# EAGLE schematic pm2018 (EAGLE 9.0.0)
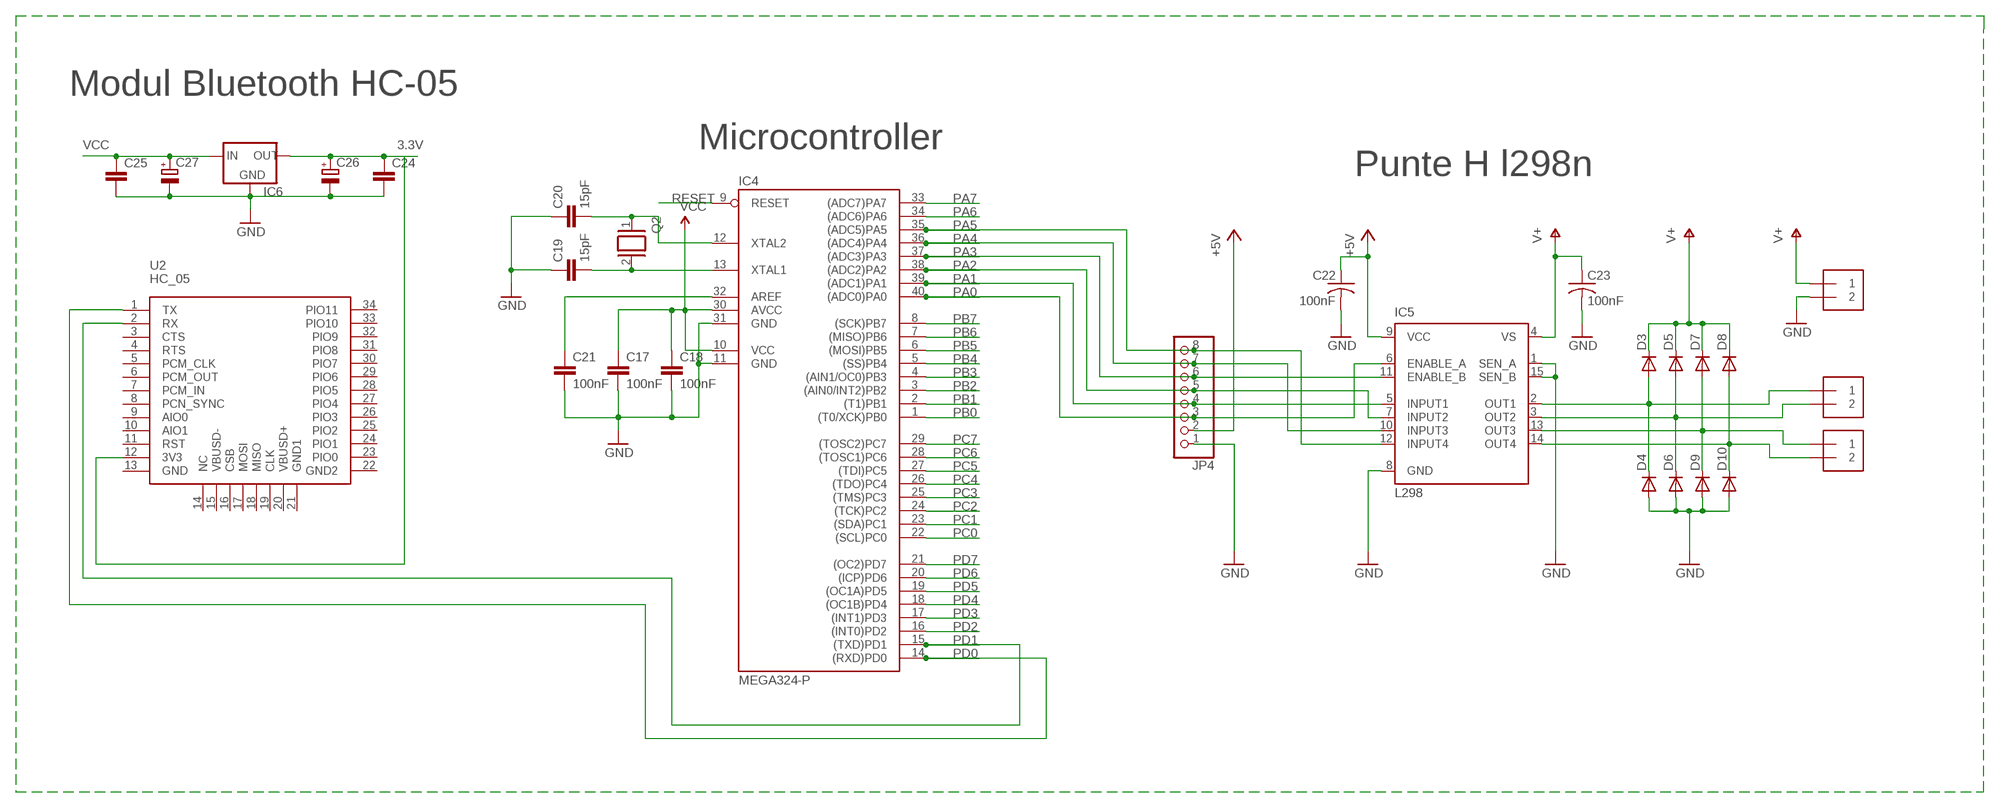
[diagram p0: schematic, sheet 1]

## Parts
C17  100nF  C-EUC_PM  [C025-025X050]
C18  100nF  C-EUC_PM  [C025-025X050]
C19  15pF  C-EUC_PM  [C025-025X050]
C20  15pF  C-EUC_PM  [C025-025X050]
C21  100nF  C-EUC_PM  [C025-025X050]
C22  100nF  C-US050-024X044  [C050-024X044]
C23  100nF  C-US050-024X044  [C050-024X044]
C24  C2,5-3  [C2.5-3]
C25  C2,5-3  [C2.5-3]
C26  CPOL-EUE5-5  [E5-5]
C27  CPOL-EUE5-5  [E5-5]
D3  DIODE-D-5  [D-5]
D4  DIODE-D-5  [D-5]
D5  DIODE-D-5  [D-5]
D6  DIODE-D-5  [D-5]
D7  DIODE-D-5  [D-5]
D8  DIODE-D-5  [D-5]
D9  DIODE-D-5  [D-5]
D10  DIODE-D-5  [D-5]
IC4  MEGA324-P  MEGA16-P  [DIL40]
IC5  L298  [MULTIWATT-15]
IC6  MCP1700INLINE  [TO92-INLINE]
J4  1X2-3.5MM  [1X2-3.5MM]
J5  1X2-3.5MM  [1X2-3.5MM]
J6  1X2-3.5MM  [1X2-3.5MM]
JP4  PINHD-1X8  [1X08]
Q2  XTAL/S  [QS]
U2  HC_05  [BLUETOOTH_SMD]

## Nets
3.3V: C24.1 C26.+ IC6.3(OUT) U2.12(3V3)
+5V: C22.1 IC5.9(VCC) JP4.2
GND: C17.2 C18.2 C19.1 C20.1 C21.2 C22.2 C23.2 C24.2 C25.2 C26.- C27.- D4.A D6.A D9.A D10.A IC4.11(GND) IC4.31(GND) IC5.1(SEN_A) IC5.8(GND) IC5.15(SEN_B) IC6.1(GND) J4.2 JP4.1
N$11: D3.A D4.C IC5.2(OUT1) J5.1
N$12: D5.A D6.C IC5.3(OUT2) J5.2
N$13: C21.1 IC4.32(AREF)
N$19: C19.2 IC4.13(XTAL1) Q2.2
N$23: C20.2 IC4.12(XTAL2) Q2.1
N$24: D8.A D10.C IC5.14(OUT4) J6.2
N$25: D7.A D9.C IC5.13(OUT3) J6.1
PA0: IC4.40((ADC0)PA0) IC5.6(ENABLE_A) JP4.3
PA1: IC4.39((ADC1)PA1) IC5.5(INPUT1) JP4.4
PA2: IC4.38((ADC2)PA2) IC5.7(INPUT2) JP4.5
PA3: IC4.37((ADC3)PA3) IC5.11(ENABLE_B) JP4.6
PA4: IC4.36((ADC4)PA4) IC5.10(INPUT3) JP4.7
PA5: IC4.35((ADC5)PA5) IC5.12(INPUT4) JP4.8
PA6: IC4.34((ADC6)PA6)
PA7: IC4.33((ADC7)PA7)
PB0: IC4.1((T0/XCK)PB0)
PB1: IC4.2((T1)PB1)
PB2: IC4.3((AIN0/INT2)PB2)
PB3: IC4.4((AIN1/OC0)PB3)
PB4: IC4.5((SS)PB4)
PB5: IC4.6((MOSI)PB5)
PB6: IC4.7((MISO)PB6)
PB7: IC4.8((SCK)PB7)
PC0: IC4.22((SCL)PC0)
PC1: IC4.23((SDA)PC1)
PC2: IC4.24((TCK)PC2)
PC3: IC4.25((TMS)PC3)
PC4: IC4.26((TDO)PC4)
PC5: IC4.27((TDI)PC5)
PC6: IC4.28((TOSC1)PC6)
PC7: IC4.29((TOSC2)PC7)
PD0: IC4.14((RXD)PD0) U2.1(TX)
PD1: IC4.15((TXD)PD1) U2.2(RX)
PD2: IC4.16((INT0)PD2)
PD3: IC4.17((INT1)PD3)
PD4: IC4.18((OC1B)PD4)
PD5: IC4.19((OC1A)PD5)
PD6: IC4.20((ICP)PD6)
PD7: IC4.21((OC2)PD7)
RESET: IC4.9(RESET)
V+: C23.1 D3.C D5.C D7.C D8.C IC5.4(VS) J4.1
VCC: C17.1 C18.1 C25.1 C27.+ IC4.10(VCC) IC4.30(AVCC) IC6.2(IN)
Unconnected: U2.3(CTS) U2.4(RTS) U2.5(PCM_CLK) U2.6(PCM_OUT) U2.7(PCM_IN) U2.8(PCN_SYNC) U2.9(AIO0) U2.10(AIO1) U2.11(RST) U2.13(GND) U2.14(NC) U2.15(VBUSD-) U2.16(CSB) U2.17(MOSI) U2.18(MISO) U2.19(CLK) U2.20(VBUSD+) U2.21(GND1) U2.22(GND2) U2.23(PIO0) U2.24(PIO1) U2.25(PIO2) U2.26(PIO3) U2.27(PIO4) U2.28(PIO5) U2.29(PIO6) U2.30(PIO7) U2.31(PIO8) U2.32(PIO9) U2.33(PIO10) U2.34(PIO11)

## Notes on the sheet
- Modul Bluetooth HC-05
- Microcontroller
- Punte H l298n

## Library data of the parts
C17-C21 = 0andrei_custom:C-EU: CAPACITOR, European symbol
C22 C23 = rcl:C-US: CAPACITOR, American symbol
C24 C25 = capacitor-wima:C: CAPACITOR naming: grid - package width
C26 C27 = rcl:CPOL-EU: POLARIZED CAPACITOR, European symbol
D3-D10 = diode:DIODE-: DIODE
IC4 = atmel:MEGA16-P: MICROCONTROLLER 16 Kbytes FLASH 1 kbytes SRAM 512 bytes EEPROM USART 8-channel 10 bit ADC Source: avr.lbr; MPN: ATMEGA16-16PU; OC_FARNELL: 9171142; OC_NEWARK: 01M6885
IC5 = st-microelectronics:L298: DUAL FULL-BRIDGE DRIVER; MPN: L298N; OC_FARNELL: 1589425; OC_NEWARK: 32M1527
IC6 = adafruit:MCP1700: VOLTAGE REGULATOR
J4-J6 = adafruit:1X2: 3.5mm Terminal block http://www.ladyada.net/library/pcb/eaglelibrary.html
JP4 = pinhead:PINHD-1X8: PIN HEADER
Q2 = special:XTAL/S: CRYSTAL
U2 = Bluetooth HC-05:HC_05: HC-05 Bluetooth Module

## Net classes
1 power: width 0.61 mm